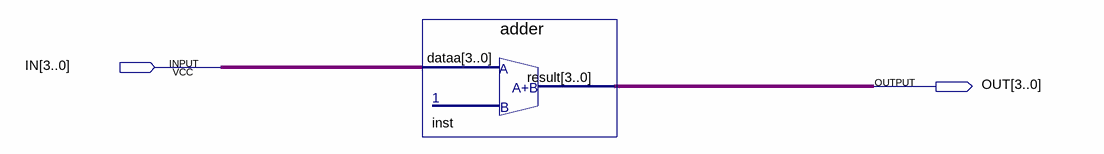
[diagram p0: schematic sheet]
// Quartus schematic Block1.bdf as structural Verilog: 1 symbols, 2 pins
module Block1 (
  input  [3:0] IN,
  output [3:0] OUT
);

  adder inst (.dataa(IN), .result(OUT));
endmodule
